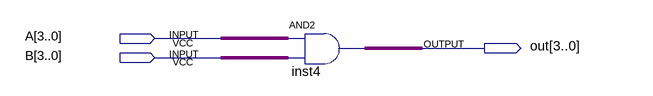
[diagram p0: schematic sheet]
// Quartus schematic And_4bit.bdf as structural Verilog: 1 symbols, 3 pins
module And_4bit (
  input  [3:0] A,
  input  [3:0] B,
  output [3:0] out
);

  assign out = A & B;  // AND2 inst4, 4 bits wide
endmodule
